# Altium schematic sheet LCD.SchDoc
size A
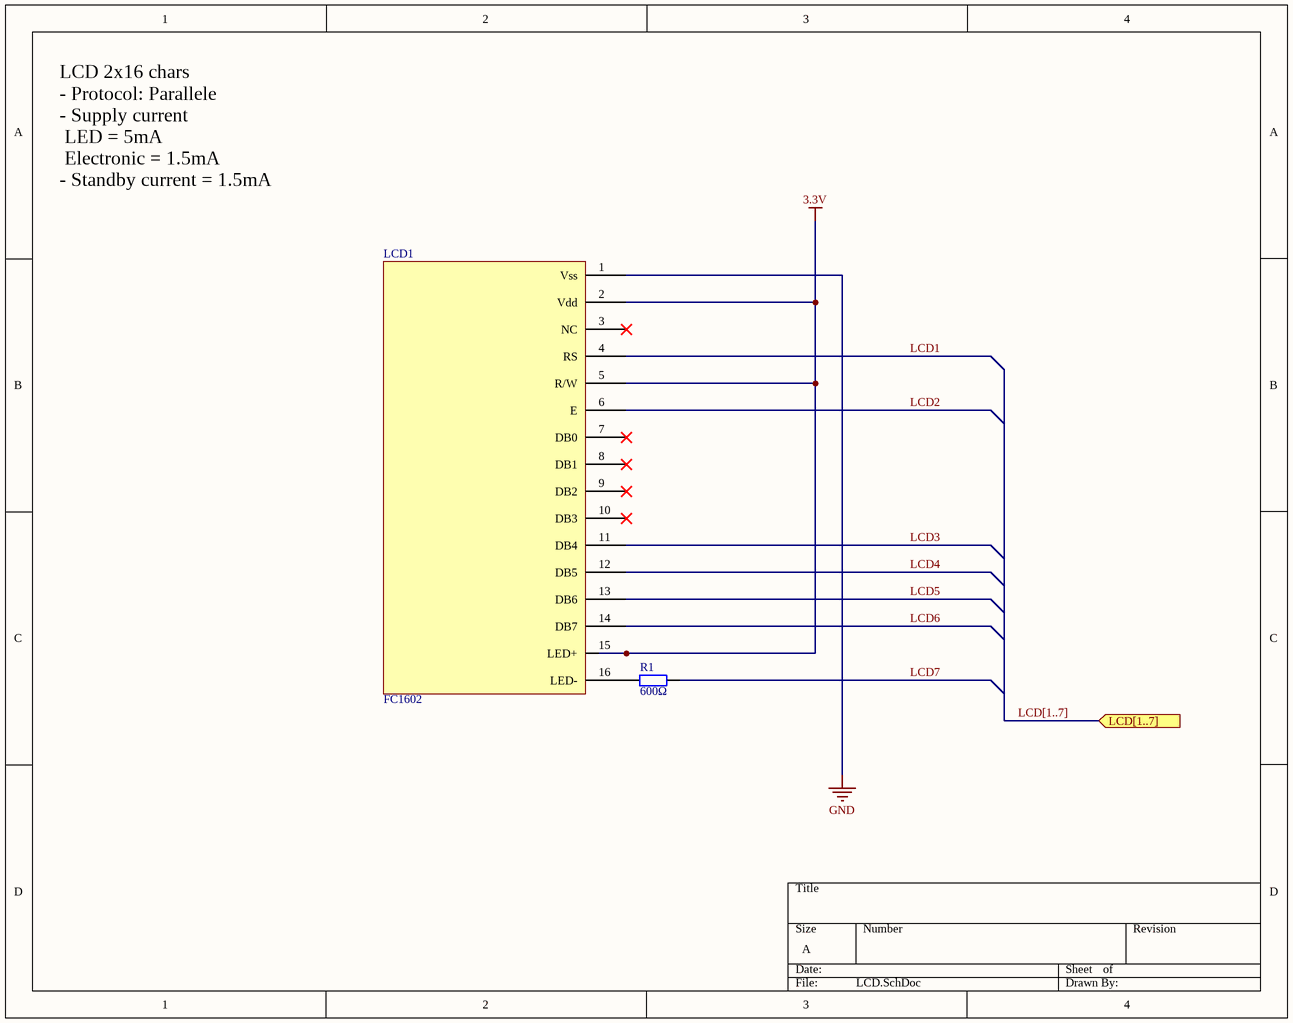
[diagram p0: LCD.SchDoc]

## Parts
LCD1  FC1602
R1  600Ω  [AXIAL-0.4]

## Ports
LCD[1..7] (in)

## Nets
3.3V: LCD1.2(Vdd) LCD1.5(R/W) LCD1.15(LED+)
GND: LCD1.1(Vss)
LCD1: LCD1.4(RS)
LCD2: LCD1.6(E)
LCD3: LCD1.11(DB4)
LCD4: LCD1.12(DB5)
LCD5: LCD1.13(DB6)
LCD6: LCD1.14(DB7)
LCD7: R1.1
NetLCD1_16: LCD1.16(LED-) R1.2

Not connected (* = marked no-connect by the designer): LCD1 3(NC)* 7(DB0)* 8(DB1)* 9(DB2)* 10(DB3)*

## Buses and harness runs
bus LCD[1..7] = port LCD[1..7]

## Notes on the sheet
- LCD 2x16 chars
  - Protocol: Parallele
  - Supply current
  LED	= 5mA
  Electronic	= 1.5mA
  - Standby current = 1.5mA

## Library data of the parts
LCD1 = Component_1
R1 = Res2: Resistor; Value: 1K; Published: 8-Jun-2000; LatestRevisionDate: 17-Jul-2002; LatestRevisionNote: Re-released for DXP Platform.; PackageReference: AXIAL-0.4; Publisher: Altium Limited; PackageDescription: Axial Device, Thru-Hole; 2 Leads; 0.4 in Pin Spacing